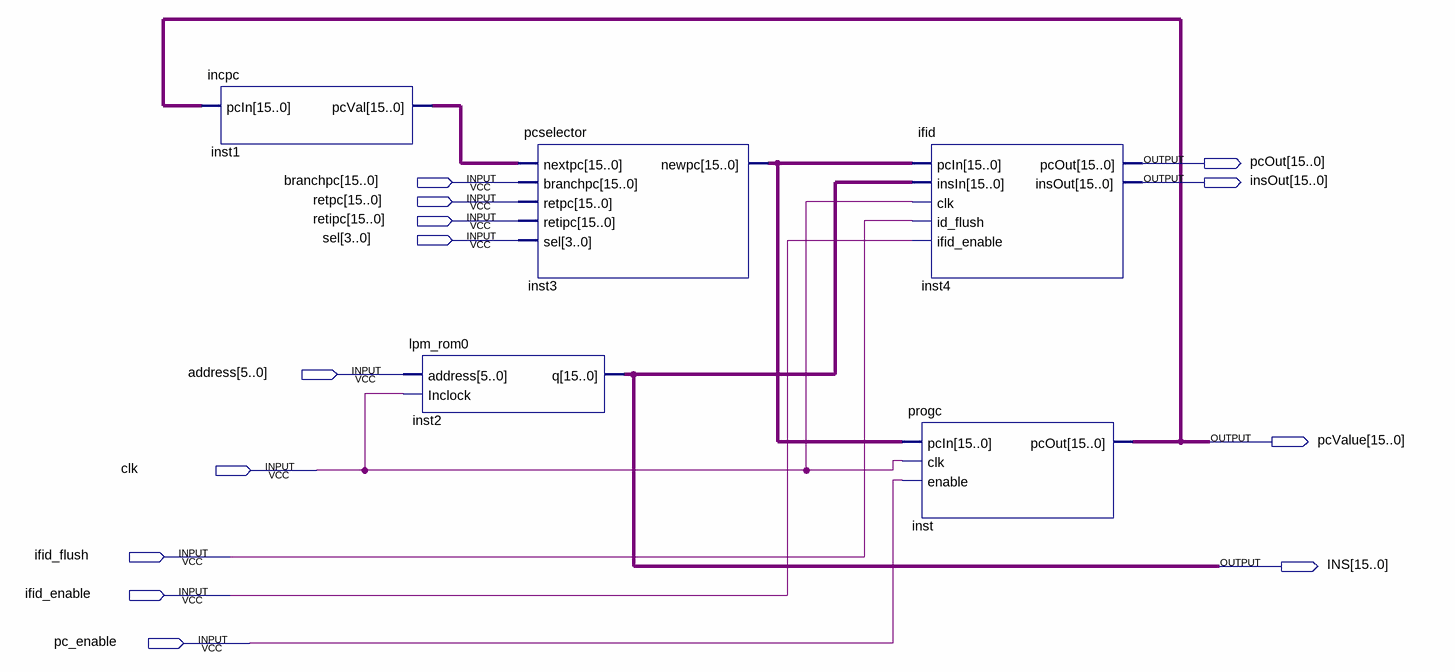
[diagram p0: schematic sheet]
// Quartus schematic stage1.bdf as structural Verilog: 5 symbols, 13 pins
module stage1 (
  input  [15:0] branchpc,
  input  [15:0] retpc,
  input  [15:0] retipc,
  input  [3:0] sel,
  input  [5:0] address,
  input  clk,
  input  ifid_flush,
  input  ifid_enable,
  input  pc_enable,
  output [15:0] pcOut,
  output [15:0] insOut,
  output [15:0] pcValue,
  output [15:0] INS
);

  wire [15:0] inst1_pcval, inst3_newpc;

  incpc inst1 (.pcIn(pcValue), .pcVal(inst1_pcval));
  lpm_rom0 inst2 (.address(address), .Inclock(clk), .q(INS));
  pcselector inst3 (
    .nextpc(inst1_pcval), .branchpc(branchpc), .retpc(retpc), .retipc(retipc), .sel(sel), .newpc(inst3_newpc));
  ifid inst4 (
    .pcIn(inst3_newpc), .insIn(INS), .clk(clk), .id_flush(ifid_flush), .ifid_enable(ifid_enable),
    .pcOut(pcOut), .insOut(insOut));
  progc inst (.pcIn(inst3_newpc), .clk(clk), .enable(pc_enable), .pcOut(pcValue));
endmodule
